# Altium schematic sheet Fly-Back Entera.SchDoc
size A4
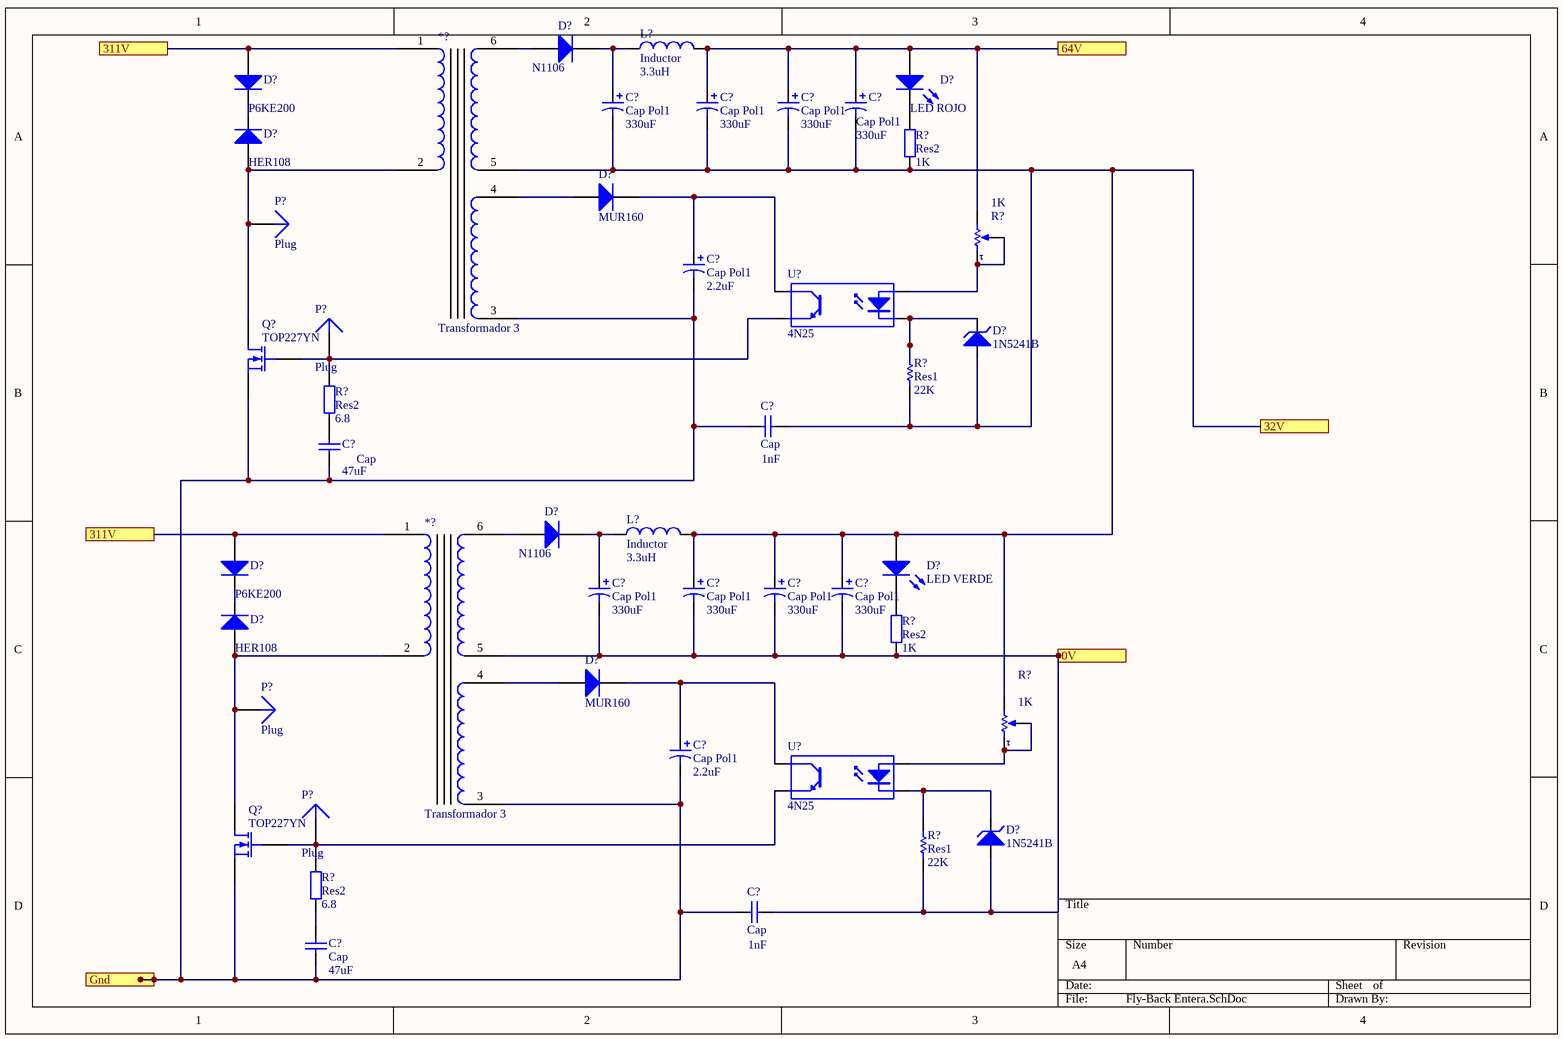
[diagram p0: Fly-Back Entera.SchDoc]

## Parts
(Parts that share a designator on the sheet are numbered #1, #2 ... from top to bottom, then left to right.)
*?#1  Transformador 3  [Transformador_flyback - duplicate]
*?#2  Transformador 3  [Transformador_flyback - duplicate]
C?#1  Cap Pol1  value 330uF  [CAPR D500 H1200 R200 mil]
C?#2  Cap Pol1  value 330uF  [CAPR D500 H1200 R200 mil]
C?#3  Cap Pol1  value 330uF  [CAPR D500 H1200 R200 mil]
C?#4  Cap Pol1  value 330uF  [CAPR D500 H1200 R200 mil]
C?#5  Cap Pol1  value 2.2uF  [CAPR D200 H450 R100 mil]
C?#6  Cap  value 1nF  [RAD-0.2]
C?#7  Cap  value 47uF  [CAPR D250 H450 R100 mil]
C?#8  Cap Pol1  value 330uF  [CAPR D500 H1200 R200 mil]
C?#9  Cap Pol1  value 330uF  [CAPR D500 H1200 R200 mil]
C?#10  Cap Pol1  value 330uF  [CAPR D500 H1200 R200 mil]
C?#11  Cap Pol1  value 330uF  [CAPR D500 H1200 R200 mil]
C?#12  Cap Pol1  value 2.2uF  [CAPR D200 H450 R100 mil]
C?#13  Cap  value 1nF  [RAD-0.2]
C?#14  Cap  value 47uF  [CAPR D250 H450 R100 mil]
D?#1  N1106  [TO-220_A]
D?#2  P6KE200  [DO-15]
D?#3  LED ROJO  [Led 5mm ROJO]
D?#4  HER108  [DO-41]
D?#5  MUR160  [DO-41]
D?#6  VALOR: 1N5241B  [DO-41]  (hidden comment: Diodo Zener)
D?#7  N1106  [TO-220_A]
D?#8  P6KE200  [DO-15]
D?#9  LED VERDE  [Led 5mm ROJO]
D?#10  HER108  [DO-41]
D?#11  MUR160  [DO-41]
D?#12  VALOR: 1N5241B  [DO-41]  (hidden comment: Diodo Zener)
L?#1  Inductor  value 3.3uH  [Bobina 1.5*3]
L?#2  Inductor  value 3.3uH  [Bobina 1.5*3]
P?#1  Plug  [PIN1]
P?#2  Plug  [PIN1]
P?#3  Plug  [PIN1]
P?#4  Plug  [PIN1]
Q?#1  TOP227YN  [TO-220AB]
Q?#2  TOP227YN  [TO-220AB]
R?#1  Res2  value 1K  [1206 resistor]
R?#2  VALOR: 1K  [Trimpot Horizontal]  (hidden comment: Trimpot)
R?#3  Res1  value 22K  [1206 resistor]
R?#4  Res2  value 6.8  [1206 resistor]
R?#5  Res2  value 1K  [1206 resistor]
R?#6  VALOR: 1K  [Trimpot Horizontal]  (hidden comment: Trimpot)
R?#7  Res1  value 22K  [1206 resistor]
R?#8  Res2  value 6.8  [1206 resistor]
U?#1  4N25  [DIP-4]
U?#2  4N25  [DIP-4]

## Ports
0V, 32V, 64V, 311V, Gnd

## Nets
0V: *?#2.5(L) C?#8.2 C?#9.2 C?#10.2 C?#11.2 C?#13.2 D?#12.1(A) R?#5.1 R?#7.1 ; port 0V
32V: *?#1.5(L) C?#1.2 C?#2.2 C?#3.2 C?#4.2 C?#6.2 C?#9.1 C?#10.1 C?#11.1 D?#6.1(A) D?#9.1(A) L?#2.2 R?#1.1 R?#3.1 R?#6.2(BOT) ; port 32V
64V: C?#2.1 C?#3.1 C?#4.1 D?#3.1(A) L?#1.2 R?#2.2(BOT) ; port 64V
311V: *?#1.1(L) *?#2.1(L) D?#2.1(A) D?#8.1(A) ; port 311V
Gnd: *?#1.3(L) *?#2.3(L) C?#5.2 C?#6.1 C?#7.1 C?#12.2 C?#13.1 C?#14.1 Q?#1.2(S) Q?#2.2(S) ; port Gnd
Net*?#1_2: *?#1.2(L) D?#4.1(A) P?#1.1 Q?#1.3(D)
Net*?#1_4: *?#1.4(L) D?#5.1(A)
Net*?#1_6: *?#1.6(L) D?#1.3(A)
Net*?#2_2: *?#2.2(L) D?#10.1(A) P?#3.1 Q?#2.3(D)
Net*?#2_4: *?#2.4(L) D?#11.1(A)
Net*?#2_6: *?#2.6(L) D?#7.3(A)
NetC?#1_1: C?#1.1 D?#1.1(K) L?#1.1
NetC?#5_1: C?#5.1 D?#5.2(K) U?#1.4(C)
NetC?#7_2: C?#7.2 R?#4.1
NetC?#8_1: C?#8.1 D?#7.1(K) L?#2.1
NetC?#12_1: C?#12.1 D?#11.2(K) U?#2.4(C)
NetC?#14_2: C?#14.2 R?#8.1
NetD?#2_2: D?#2.2(K) D?#4.2(K)
NetD?#3_2: D?#3.2(K) R?#1.2
NetD?#6_2: D?#6.2(K) R?#3.2 U?#1.2(K)
NetD?#8_2: D?#8.2(K) D?#10.2(K)
NetD?#9_2: D?#9.2(K) R?#5.2
NetD?#12_2: D?#12.2(K) R?#7.2 U?#2.2(K)
NetP?#2_1: P?#2.1 Q?#1.1(G) R?#4.2 U?#1.3(E)
NetP?#4_1: P?#4.1 Q?#2.1(G) R?#8.2 U?#2.3(E)
NetR?#2_1: R?#2.1(TOP) R?#2.3(TAP) U?#1.1(A)
NetR?#6_1: R?#6.1(TOP) R?#6.3(TAP) U?#2.1(A)

## Library data of the parts
C?#1-C?#5 C?#8-C?#12 = Cap Pol1: Polarized Capacitor (Radial); Published: 8-Jun-2000; LatestRevisionDate: 17-Jul-2002; LatestRevisionNote: Re-released for DXP Platform.; PackageReference: RB7.6-15; Publisher: Altium Limited; PackageDescription: Polarized Capacitor (Radial); 2 Leads
C?#6 C?#7 C?#13 C?#14 = Cap: Capacitor; Published: 8-Jun-2000; LatestRevisionDate: 17-Jul-2002; LatestRevisionNote: Re-released for DXP Platform.; PackageReference: RAD-0.3; Publisher: Altium Limited; PackageDescription: Radial Cap, Thru-Hole; 2 Leads; 0.3 in Pin Spacing
D?#1 D?#2 D?#4 D?#5 D?#7 D?#8 D?#10 D?#11 = Diode 1N4148: High Conductance Fast Diode; Published: 8-Jun-2000; LatestRevisionDate: 17-Jul-2002; LatestRevisionNote: Re-released for DXP Platform.; DatasheetVersion: 1997; PackageReference: DO-35; Publisher: Altium Limited; PackageDescription: Diode, Axial; Body 3.8 x 1.9 mm (LxDia. max), Lead Dia. 0.53 mm (max); Code_JEDEC: DO-204-AH; ComponentLink1Description: Manufacturer Link; ComponentLink1URL: http://www.fairchildsemi.com/; ComponentLink2Description: Datasheet; ComponentLink2URL: http://www.fairchildsemi.com/ds/1N%2F1N4148.pdf
D?#3 D?#9 = LED0: Typical INFRARED GaAs LED; Published: 8-Jun-2000; LatestRevisionDate: 08-Jul-2005; LatestRevisionNote: Mech Layer 1 removed.; PackageReference: LED-0; Publisher: Altium Limited; PackageDescription: LED; 2 Leads
L?#1 L?#2 = Inductor: Code_IEC: 1005; Published: 8-Jun-2000; LatestRevisionDate: 29-May-2009; LatestRevisionNote: IPC-7351 Footprint Added.; PackageReference: 0402-A; Publisher: Altium Limited; PackageDescription: Chip Inductor; Code_JEITA: 0402
Q?#1 Q?#2 = MOSFET-N: N-Channel MOSFET; Published: 8-Jun-2000; LatestRevisionDate: 17-Jul-2002; LatestRevisionNote: Re-released for DXP Platform.; PackageVersion: 1995/1996; PackageReference: E3; Publisher: Altium Limited; PackageDescription: TO, Flat Index; 3 In-Line, Axial Leads; Body Dia. 4.6mm; Lead Dia. 0.5 mm (max)
R?#1 R?#4 R?#5 R?#8 = Res2: Resistor; Published: 8-Jun-2000; LatestRevisionDate: 17-Jul-2002; LatestRevisionNote: Re-released for DXP Platform.; PackageReference: AXIAL-0.4; Publisher: Altium Limited; PackageDescription: Axial Device, Thru-Hole; 2 Leads; 0.4 in Pin Spacing
R?#2 R?#6 = Trimpot: Preset; CODIGO STI: *; PROVEEDOR: *; FABRICANTE: *
R?#3 R?#7 = Res1: Resistor; Published: 8-Jun-2000; LatestRevisionDate: 17-Jul-2002; LatestRevisionNote: Re-released for DXP Platform.; PackageReference: AXIAL-0.3; Publisher: Altium Limited; PackageDescription: Axial Device, Thru-Hole; 2 Leads; 0.3 in Pin Spacing
U?#1 U?#2 = Optoisolator1: 4-Pin Phototransistor Optocoupler; Published: 24-Mar-1999; LatestRevisionDate: 04-Mar-2005; LatestRevisionNote: Sch pins 3 & 4 Swapped.; DatasheetVersion: Nov-2003; PackageReference: DIP-4; Publisher: Altium Limited
D?#6 D?#12 = Diodo Zener: CODIGO STI: *; PROVEEDOR: *; FABRICANTE: *
P?#1-P?#4 = Plug: LatestRevisionDate: 17-Jul-2002; LatestRevisionNote: Re-released for DXP Platform.; Publisher: Altium Limited